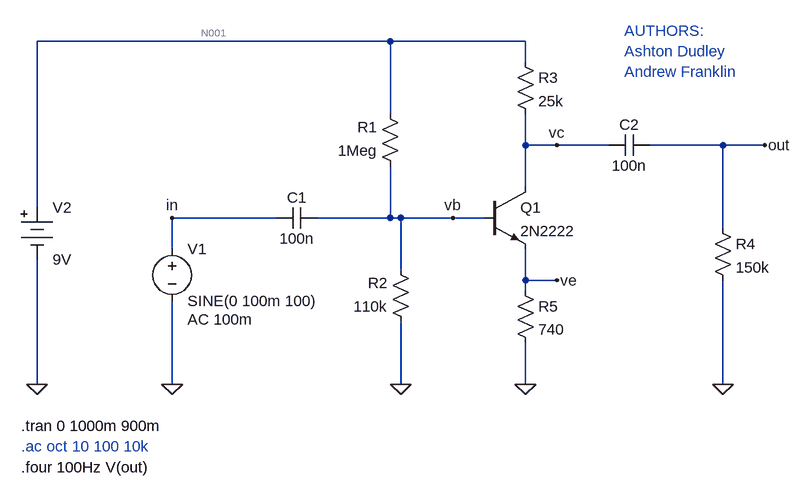
[diagram p0: schematic Lab 3 Amplifer V1.asc]
Lab 3 Amplifer V1.asc, the LTspice schematic file:
Version 4.1
SHEET 1 880 720
WIRE 0 -144 -544 -144
WIRE 208 -144 0 -144
WIRE 208 -112 208 -144
WIRE 0 -32 0 -144
WIRE 208 16 208 -32
WIRE 256 16 208 16
WIRE 336 16 256 16
WIRE 512 16 400 16
WIRE 576 16 512 16
WIRE 208 80 208 16
WIRE -544 112 -544 -144
WIRE -176 128 -336 128
WIRE 0 128 0 48
WIRE 0 128 -112 128
WIRE 16 128 0 128
WIRE 96 128 16 128
WIRE 144 128 96 128
WIRE 512 144 512 16
WIRE -336 176 -336 128
WIRE 16 208 16 128
WIRE 208 224 208 176
WIRE 256 224 208 224
WIRE 208 240 208 224
WIRE -544 384 -544 192
WIRE -336 384 -336 256
WIRE 16 384 16 288
WIRE 208 384 208 320
WIRE 512 384 512 224
FLAG 16 384 0
FLAG 512 384 0
FLAG 576 16 out
FLAG -336 128 in
FLAG -336 384 0
FLAG 208 384 0
FLAG -544 384 0
FLAG 256 224 ve
FLAG 256 16 vc
FLAG 96 128 vb
SYMBOL npn 144 80 R0
SYMATTR InstName Q1
SYMATTR Value 2N2222
SYMBOL res 16 64 R180
WINDOW 0 36 76 Left 2
WINDOW 3 36 40 Left 2
SYMATTR InstName R1
SYMATTR Value 1Meg
SYMBOL res 32 304 R180
WINDOW 0 36 76 Left 2
WINDOW 3 36 40 Left 2
SYMATTR InstName R2
SYMATTR Value 110k
SYMBOL voltage -336 160 R0
WINDOW 123 24 124 Left 2
WINDOW 39 0 0 Left 0
SYMATTR Value2 AC 100m
SYMATTR InstName V1
SYMATTR Value SINE(0 100m 100)
SYMBOL Misc\\battery -544 96 R0
WINDOW 123 0 0 Left 0
WINDOW 39 0 0 Left 0
SYMATTR InstName V2
SYMATTR Value 9V
SYMBOL cap -112 112 R90
WINDOW 0 0 32 VBottom 2
WINDOW 3 32 32 VTop 2
SYMATTR InstName C1
SYMATTR Value 100n
SYMBOL cap 400 0 R90
WINDOW 0 0 32 VBottom 2
WINDOW 3 32 32 VTop 2
SYMATTR InstName C2
SYMATTR Value 100n
SYMBOL res 192 -128 R0
SYMATTR InstName R3
SYMATTR Value 25k
SYMBOL res 496 128 R0
SYMATTR InstName R4
SYMATTR Value 150k
SYMBOL res 192 224 R0
SYMATTR InstName R5
SYMATTR Value 740
TEXT -568 448 Left 2 !.tran 0 1000m 900m
TEXT -568 480 Left 2 ;.ac oct 10 100 10k
TEXT -568 512 Left 2 !.four 100Hz V(out)
TEXT 360 -160 Left 2 ;AUTHORS:\nAshton Dudley\nAndrew Franklin

The netlist it stands for:
* Lab 3 Amplifer V1.asc
Q1 vc vb ve 0 2N2222
R1 vb N001 1Meg
R2 0 vb 110k
V1 in 0 SINE(0 100m 100) AC 100m
V2 N001 0 9V
C1 vb in 100n
C2 out vc 100n
R3 N001 vc 25k
R4 out 0 150k
R5 ve 0 740
.model NPN NPN
.model PNP PNP
.lib standard.bjt
.tran 0 1000m 900m
* .ac oct 10 100 10k
.four 100Hz V(out)
* AUTHORS:
* Ashton Dudley
* Andrew Franklin
.backanno
.end

* Results of the author's LTspice run, read from the files saved beside the schematic
* Operating Point, zero values left out:
*   V(n001) = 9 V
*   V(vb) = 783.2 mV
*   V(vc) = 3.377 V
*   V(ve) = 167.2 mV
*   I(R1) = -8.217 µA
*   I(R2) = -7.12 µA
*   I(R3) = 224.9 µA
*   I(R5) = 226 µA
*   I(V2) = -233.1 µA
*   Ib(Q1) = 1.097 µA
*   Ic(Q1) = 224.9 µA
*   Ie(Q1) = -226 µA
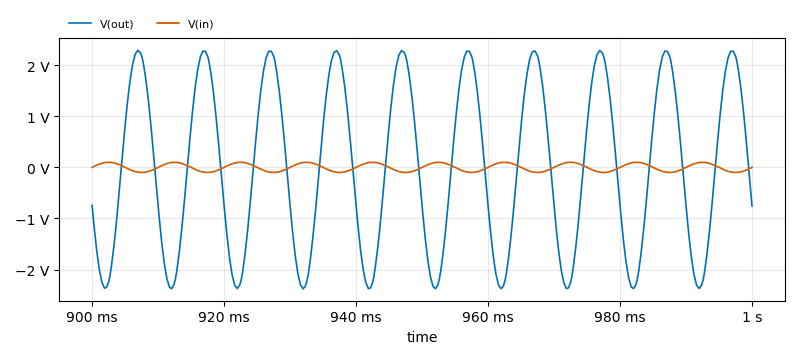
[diagram p1: Transient Analysis of Lab 3 Amplifer V1.asc, plotted from the saved traces]
* Transient Analysis, 1 run:
*   V(out): min -2.377 V, max 2.291 V, average -404.7 µV, rms 1.656 V, last -755.5 mV
*   V(in): min -100 mV, max 100 mV, average 7.598 µV, rms 70.77 mV, last 0 V
* From the log:
*   Fourier components of V(out)
*   N-Period=1
*   DC component:-0.000622714
*   Harmonic  Frequency   Fourier   Normalized   Phase    Normalized
*    Number     [Hz]     Component   Component  [degree]  Phase [deg]
*       1      1.000e+02   2.329e+00   1.000e+00   -109.29°      0.00°
*       2      2.000e+02   3.943e-02   1.693e-02    -34.85°     74.44°
*       3      3.000e+02   6.514e-03   2.797e-03    145.85°    255.14°
*       4      4.000e+02   1.578e-03   6.774e-04    148.52°    257.81°
*       5      5.000e+02   5.292e-03   2.272e-03    -70.93°     38.36°
*       6      6.000e+02   1.144e-04   4.912e-05   -145.94°    -36.65°
*       7      7.000e+02   4.290e-03   1.842e-03    123.84°    233.13°
*       8      8.000e+02   7.577e-04   3.253e-04    123.27°    232.56°
*       9      9.000e+02   2.066e-03   8.869e-04    -48.74°     60.55°
*   Partial Harmonic Distortion: 1.744833%
*   Total Harmonic Distortion:   1.760594%